# Altium project yaesu_interface.PrjPcb
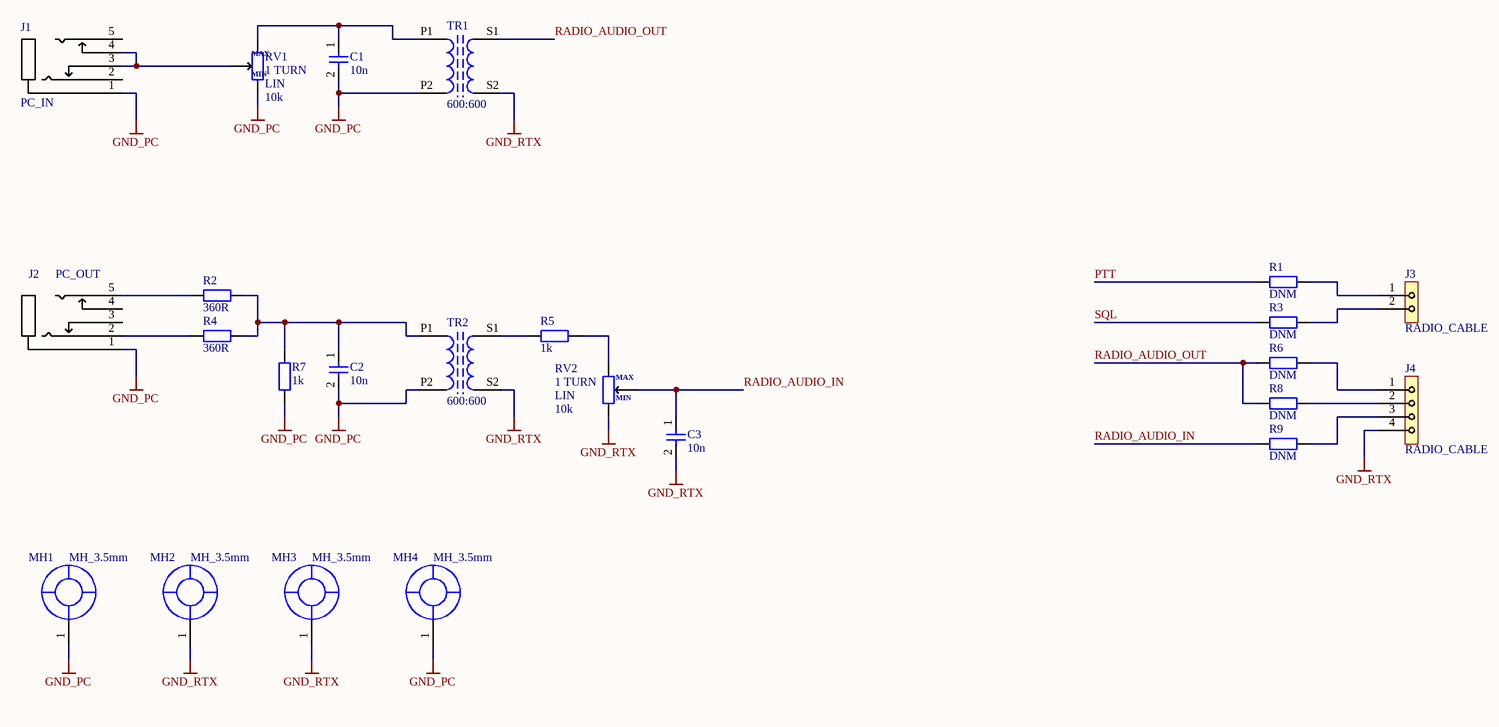
[diagram p0: interface.SchDoc]
1 sheet, 24 parts. Net scope: global (net labels, ports and power ports of the same name join across sheets).
Board file: interface.PcbDoc

## Sheet interface.SchDoc
size A3; SheetNumber: 1; SheetTotal: 1

### Parts
C1  10n  [FP-1206-L_3_2_0_2-W_1_6_0-IPC_B]
C2  10n  [FP-1206-L_3_2_0_2-W_1_6_0-IPC_B]
C3  10n  [FP-1206-L_3_2_0_2-W_1_6_0-IPC_B]
J1  PC_IN  [ACA-115]
J2  PC_OUT  [ACA-115]
J3  RADIO_CABLE  [PIN_HEADER_1L_2P]
J4  RADIO_CABLE  [PIN_HEADER_1L_4P]
MH1  MH_3.5mm  [MOUNTING_HOLE_GROUNDED]
MH2  MH_3.5mm  [MOUNTING_HOLE_GROUNDED]
MH3  MH_3.5mm  [MOUNTING_HOLE_GROUNDED]
MH4  MH_3.5mm  [MOUNTING_HOLE_GROUNDED]
R1  Resistance: DNM  [FP-CRCW1206-e3-IPC_B]  (hidden comment: Resistor)
R2  Resistance: 360R  [FP-CRCW1206-e3-IPC_B]  (hidden comment: Resistor)
R3  Resistance: DNM  [FP-CRCW1206-e3-IPC_B]  (hidden comment: Resistor)
R4  Resistance: 360R  [FP-CRCW1206-e3-IPC_B]  (hidden comment: Resistor)
R5  Resistance: 1k  [FP-CRCW1206-e3-IPC_B]  (hidden comment: Resistor)
R6  Resistance: DNM  [FP-CRCW1206-e3-IPC_B]  (hidden comment: Resistor)
R7  Resistance: 1k  [FP-CRCW1206-e3-IPC_B]  (hidden comment: Resistor)
R8  Resistance: DNM  [FP-CRCW1206-e3-IPC_B]  (hidden comment: Resistor)
R9  Resistance: DNM  [FP-CRCW1206-e3-IPC_B]  (hidden comment: Resistor)
RV1  1 TURN  Type: LIN  Resistance: 10k  [POT_THT_200MIL]
RV2  1 TURN  Type: LIN  Resistance: 10k  [POT_THT_200MIL]
TR1  600:600  [TRANSFORMER_600_600_THT_RED]
TR2  600:600  [TRANSFORMER_600_600_THT_RED]

### Nets
GND_PC: C1.2 C2.2 J1.1 J2.1 MH1.1 MH4.1 R7.2 RV1.1 TR1.P2 TR2.P2
GND_RTX: C3.2 J4.4 MH2.1 MH3.1 RV2.1 TR1.S2 TR2.S2
PTT: R1.1
RADIO_AUDIO_IN: C3.1 R9.1 RV2.2
RADIO_AUDIO_OUT: R6.1 R8.1 TR1.S1
SQL: R3.1
NetC1_1: C1.1 RV1.3 TR1.P1
NetC2_1: C2.1 R2.2 R4.2 R7.1 TR2.P1
NetJ1_3: J1.3 J1.4 RV1.2
NetJ2_2: J2.2 R4.1
NetJ2_5: J2.5 R2.1
NetJ3_1: J3.1 R1.2
NetJ3_2: J3.2 R3.2
NetJ4_1: J4.1 R6.2
NetJ4_2: J4.2 R8.2
NetJ4_3: J4.3 R9.2
NetR5_1: R5.1 TR2.S1
NetR5_2: R5.2 RV2.3

Not connected (* = marked no-connect by the designer): J1 2 5; J2 3 4

### Notes on the sheet
- (in symbol POT) MAX; MIN

### Library data of the parts
C1-C3 = cap_unpol
J1 J2 = JACK_CONNECTOR: Jack, 3.5mm stereo, 2 switch
J3 = PIN_HEADER_1L_2P
J4 = PIN_HEADER_1L_4P
MH1-MH4 = MOUNTING_HOLE_3.5mm_1: 3.5mm grounded mounting hole
R1-R9 = Resistor: EU symbol
RV1 RV2 = POT
TR1 TR2 = Transformer: 1 Primer; 1 Seconder